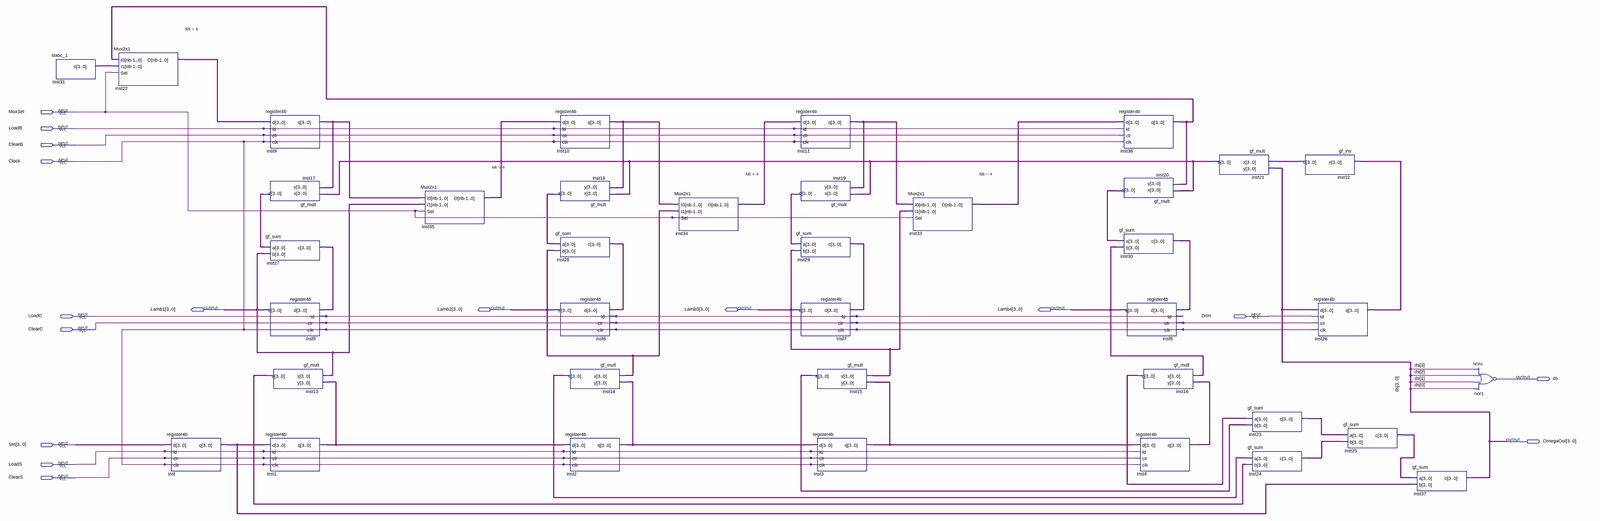
[diagram p0: schematic sheet, whole]
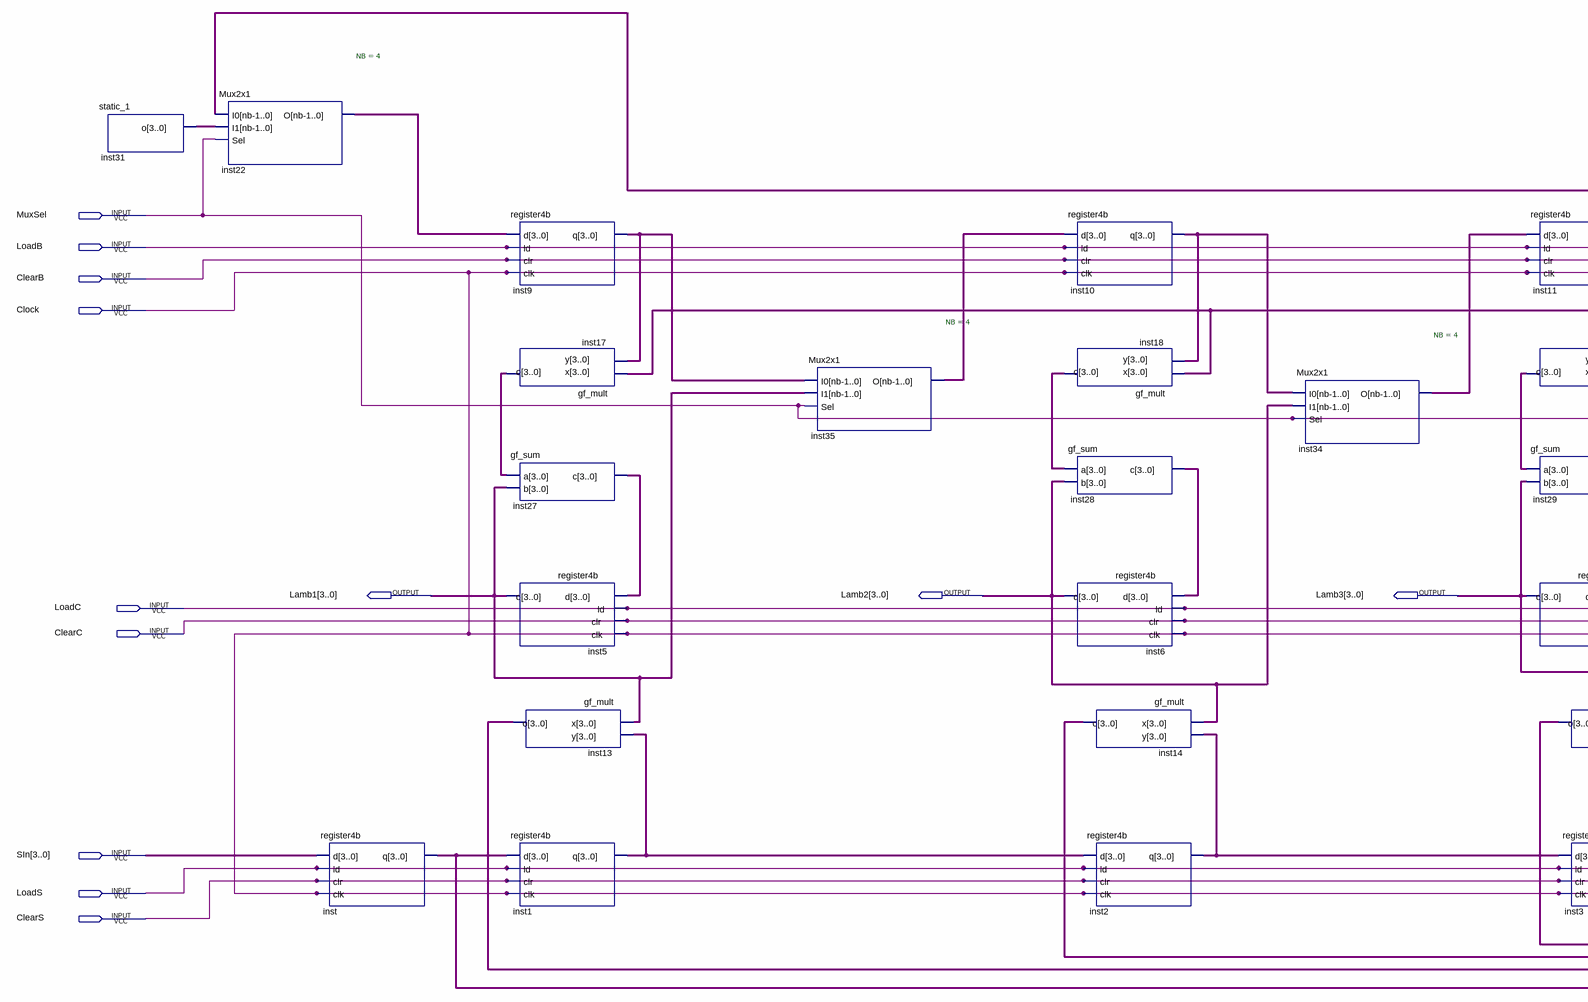
[diagram p1: schematic sheet, left part]
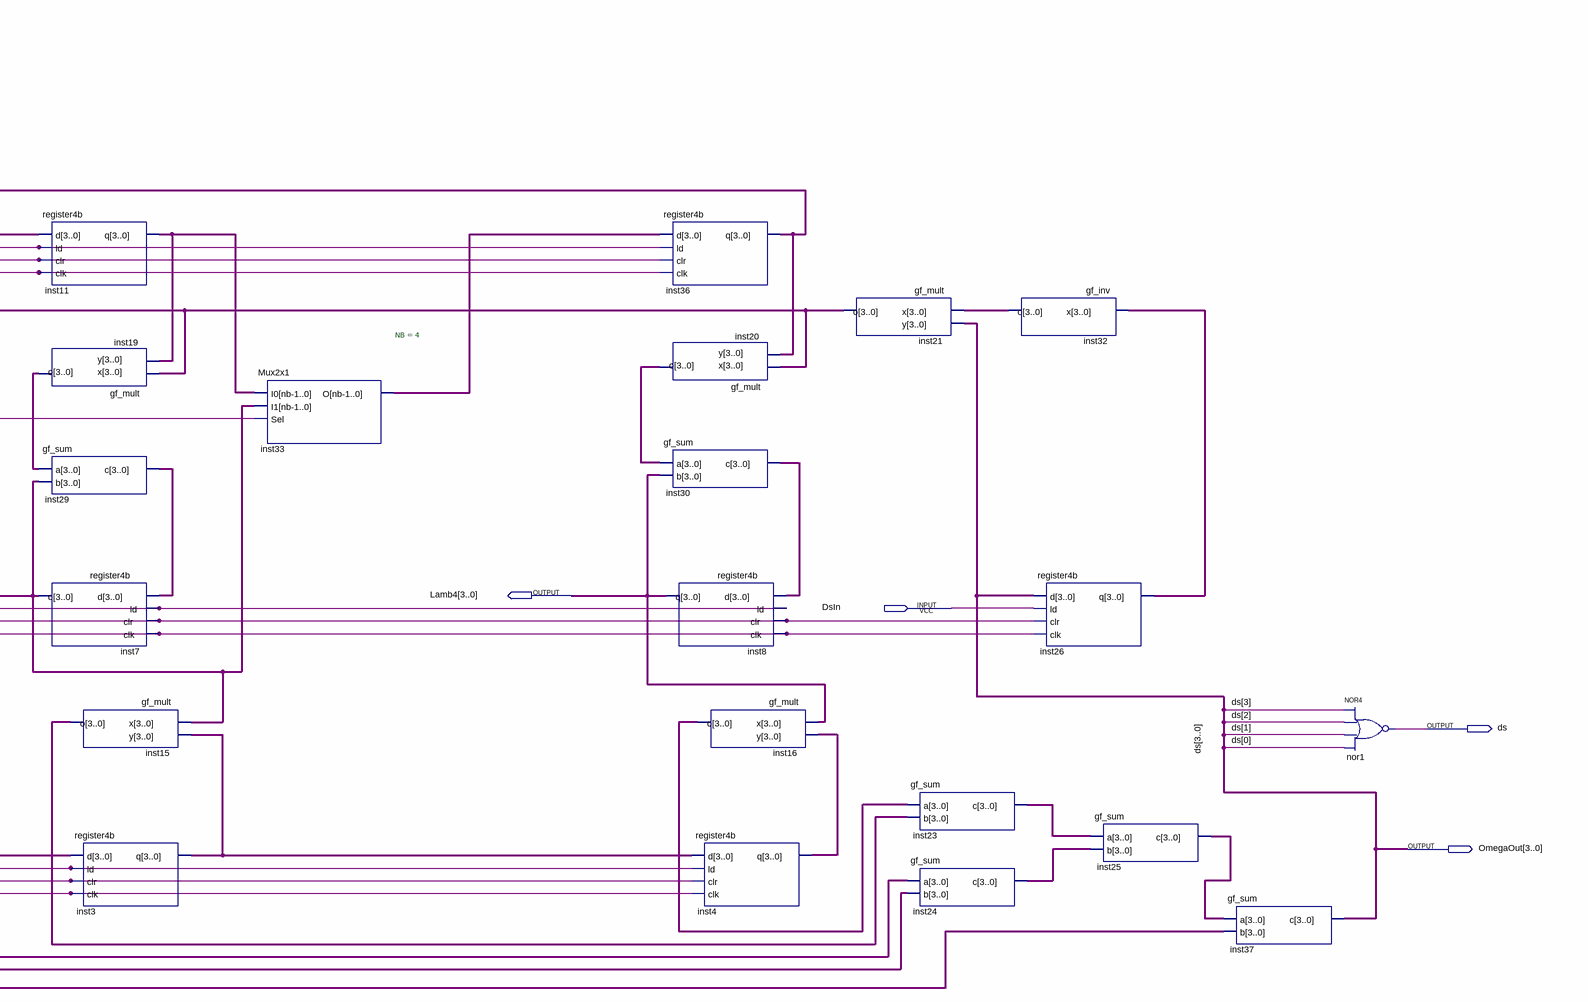
[diagram p2: schematic sheet, right part]
// Quartus schematic Berlekamp_Massey.bdf as structural Verilog: 38 symbols, 16 pins
module Berlekamp_Massey (
  input  MuxSel,
  input  LoadB,
  input  ClearB,
  input  Clock,
  input  LoadC,
  input  DsIn,
  input  ClearC,
  input  [3:0] SIn,
  input  LoadS,
  input  ClearS,
  output [3:0] Lamb1,
  output [3:0] Lamb2,
  output [3:0] Lamb3,
  output [3:0] Lamb4,
  output ds,
  output [3:0] OmegaOut
);

  wire [3:0] inst1_q, inst2_q, inst3_q, inst4_q, inst9_q, inst10_q, inst11_q, inst13_o, inst14_o, inst15_o,
       inst16_o, inst17_o, inst18_o, inst19_o, inst20_o, inst21_o, inst22_o, inst23_c, inst24_c, inst25_c,
       inst26_q, inst27_c, inst28_c, inst29_c, inst30_c, inst31_o, inst32_o, inst33_o, inst34_o, inst35_o,
       inst36_q, inst_q;

  static_1 inst31 (.o(inst31_o));
  Mux2x1 #(.NB(4)) inst22 (.I0(inst36_q), .I1(inst31_o), .Sel(MuxSel), .O(inst22_o));
  register4b inst (.d(SIn), .ld(LoadS), .clr(ClearS), .clk(Clock), .q(inst_q));
  register4b inst9 (.d(inst22_o), .ld(LoadB), .clr(ClearB), .clk(Clock), .q(inst9_q));
  gf_mult inst17 (.x(inst21_o), .y(inst9_q), .o(inst17_o));
  gf_sum inst27 (.a(inst17_o), .b(Lamb1), .c(inst27_c));
  register4b inst5 (.d(inst27_c), .ld(LoadC), .clr(ClearC), .clk(Clock), .q(Lamb1));
  gf_mult inst13 (.x(Lamb1), .y(inst1_q), .o(inst13_o));
  register4b inst1 (.d(inst_q), .ld(LoadS), .clr(ClearS), .clk(Clock), .q(inst1_q));
  Mux2x1 #(.NB(4)) inst35 (.I0(inst9_q), .I1(Lamb1), .Sel(MuxSel), .O(inst35_o));
  register4b inst10 (.d(inst35_o), .ld(LoadB), .clr(ClearB), .clk(Clock), .q(inst10_q));
  gf_mult inst18 (.x(inst21_o), .y(inst10_q), .o(inst18_o));
  gf_sum inst28 (.a(inst18_o), .b(Lamb2), .c(inst28_c));
  register4b inst6 (.d(inst28_c), .ld(LoadC), .clr(ClearC), .clk(Clock), .q(Lamb2));
  gf_mult inst14 (.x(Lamb2), .y(inst2_q), .o(inst14_o));
  register4b inst2 (.d(inst1_q), .ld(LoadS), .clr(ClearS), .clk(Clock), .q(inst2_q));
  Mux2x1 #(.NB(4)) inst34 (.I0(inst10_q), .I1(Lamb2), .Sel(MuxSel), .O(inst34_o));
  register4b inst11 (.d(inst34_o), .ld(LoadB), .clr(ClearB), .clk(Clock), .q(inst11_q));
  gf_mult inst19 (.x(inst21_o), .y(inst11_q), .o(inst19_o));
  gf_sum inst29 (.a(inst19_o), .b(Lamb3), .c(inst29_c));
  register4b inst7 (.d(inst29_c), .ld(LoadC), .clr(ClearC), .clk(Clock), .q(Lamb3));
  gf_mult inst15 (.x(Lamb3), .y(inst3_q), .o(inst15_o));
  register4b inst3 (.d(inst2_q), .ld(LoadS), .clr(ClearS), .clk(Clock), .q(inst3_q));
  Mux2x1 #(.NB(4)) inst33 (.I0(inst11_q), .I1(Lamb3), .Sel(MuxSel), .O(inst33_o));
  register4b inst36 (.d(inst33_o), .ld(LoadB), .clr(ClearB), .clk(Clock), .q(inst36_q));
  gf_mult inst20 (.x(inst21_o), .y(inst36_q), .o(inst20_o));
  gf_sum inst30 (.a(inst20_o), .b(Lamb4), .c(inst30_c));
  register4b inst8 (.d(inst30_c), .ld(LoadC), .clr(ClearC), .clk(Clock), .q(Lamb4));
  gf_mult inst16 (.x(Lamb4), .y(inst4_q), .o(inst16_o));
  register4b inst4 (.d(inst3_q), .ld(LoadS), .clr(ClearS), .clk(Clock), .q(inst4_q));
  gf_mult inst21 (.x(inst32_o), .y(OmegaOut), .o(inst21_o));
  gf_sum inst23 (.a(inst16_o), .b(inst15_o), .c(inst23_c));
  gf_sum inst24 (.a(inst14_o), .b(inst13_o), .c(inst24_c));
  gf_inv inst32 (.x(inst26_q), .o(inst32_o));
  register4b inst26 (.d(OmegaOut), .ld(DsIn), .clr(ClearC), .clk(Clock), .q(inst26_q));
  gf_sum inst25 (.a(inst23_c), .b(inst24_c), .c(inst25_c));
  gf_sum inst37 (.a(inst25_c), .b(inst_q), .c(OmegaOut));
  nor nor1 (ds, OmegaOut[3], OmegaOut[2], OmegaOut[1], OmegaOut[0]);

  // Other names for the same wires on the sheet: ds[3:0] = OmegaOut
endmodule
